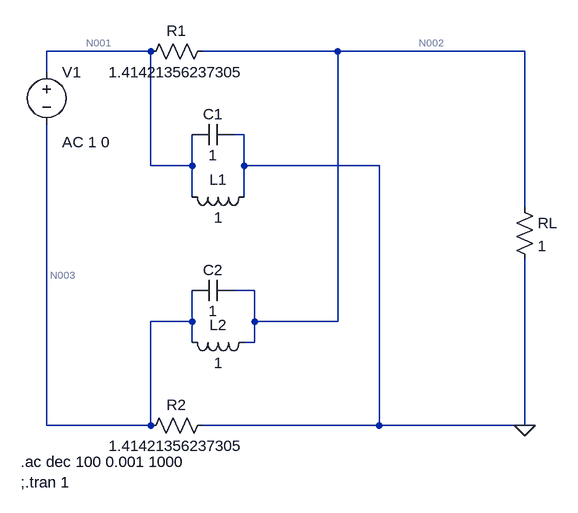
[diagram p0: schematic 20230726 - Ejercicio 1.asc]
20230726 - Ejercicio 1.asc, the LTspice schematic file:
Version 4
SHEET 1 880 756
WIRE 208 80 48 80
WIRE 496 80 288 80
WIRE 784 80 496 80
WIRE 48 112 48 80
WIRE 352 208 336 208
WIRE 208 256 208 80
WIRE 272 256 272 208
WIRE 272 256 208 256
WIRE 352 256 352 208
WIRE 560 256 352 256
WIRE 272 304 272 256
WIRE 352 304 352 256
WIRE 784 320 784 80
WIRE 368 448 336 448
WIRE 272 496 272 448
WIRE 272 496 208 496
WIRE 368 496 368 448
WIRE 496 496 496 80
WIRE 496 496 368 496
WIRE 272 528 272 496
WIRE 368 528 368 496
WIRE 368 528 352 528
WIRE 48 656 48 192
WIRE 208 656 208 496
WIRE 208 656 48 656
WIRE 560 656 560 256
WIRE 560 656 288 656
WIRE 784 656 784 400
WIRE 784 656 560 656
FLAG 784 656 0
SYMBOL voltage 48 96 R0
WINDOW 123 24 124 Left 2
WINDOW 39 0 0 Left 0
SYMATTR InstName V1
SYMATTR Value ""
SYMATTR Value2 AC 1 0
SYMBOL res 304 64 R90
WINDOW 0 0 56 VBottom 2
WINDOW 3 32 56 VTop 2
SYMATTR InstName R1
SYMATTR Value 1.41421356237305
SYMBOL cap 336 192 R90
WINDOW 0 0 32 VBottom 2
WINDOW 3 32 32 VTop 2
SYMATTR InstName C1
SYMATTR Value 1
SYMBOL ind 368 288 R90
WINDOW 0 5 56 VBottom 2
WINDOW 3 32 56 VTop 2
SYMATTR InstName L1
SYMATTR Value 1
SYMBOL res 304 640 R90
WINDOW 0 0 56 VBottom 2
WINDOW 3 32 56 VTop 2
SYMATTR InstName R2
SYMATTR Value 1.41421356237305
SYMBOL cap 336 432 R90
WINDOW 0 0 32 VBottom 2
WINDOW 3 32 32 VTop 2
SYMATTR InstName C2
SYMATTR Value 1
SYMBOL ind 368 512 R90
WINDOW 0 5 56 VBottom 2
WINDOW 3 32 56 VTop 2
SYMATTR InstName L2
SYMATTR Value 1
SYMBOL res 768 304 R0
SYMATTR InstName RL
SYMATTR Value 1
TEXT 8 712 Left 2 !.ac dec 100 0.001 1000\n;.tran 1

The netlist it stands for:
* 20230726 - Ejercicio 1.asc
V1 N001 N003 AC 1 0
R1 N002 N001 1.41421356237305
C1 0 N001 1
L1 0 N001 1
R2 0 N003 1.41421356237305
C2 N002 N003 1
L2 N002 N003 1
RL N002 0 1
.ac dec 100 0.001 1000
;.tran 1
.backanno
.end

* Results of the author's LTspice run, read from the files saved beside the schematic
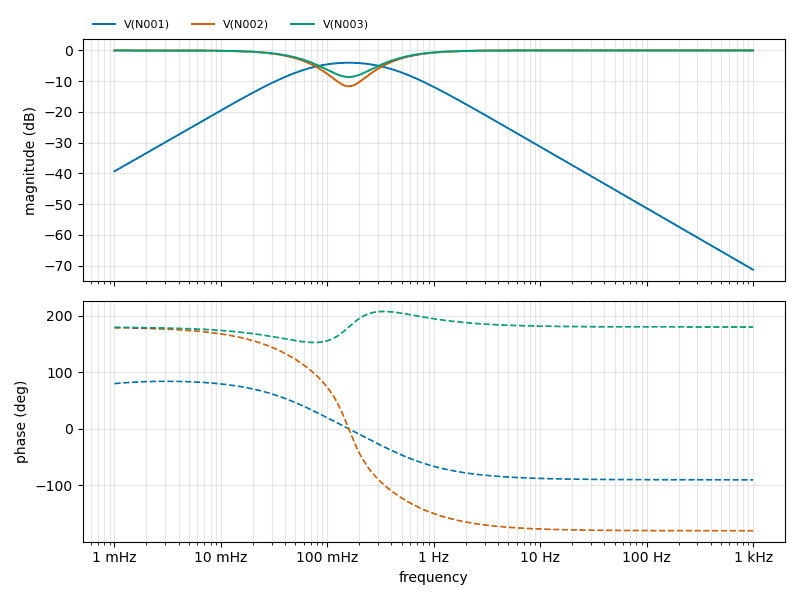
[diagram p1: AC Analysis of 20230726 - Ejercicio 1.asc, plotted from the saved traces]
* AC Analysis, 1 run:
*   V(N001): -39.31 dB at 1 mHz, -71.32 dB at 1 kHz, peak -4.01 dB at 158.5 mHz, 3 dB below the peak at 52.53 mHz and 483.5 mHz
*   V(N002): -0.03 dB at 1 mHz, -0.00 dB at 1 kHz, peak -0.00 dB at 1 kHz, 3 dB below the peak at 456 mHz
*   V(N003): -0.02 dB at 1 mHz, -0.00 dB at 1 kHz, peak -0.00 dB at 1 kHz, 3 dB below the peak at 426.7 mHz